# EAGLE design NFC_led_bar (EAGLE 9.6.2)
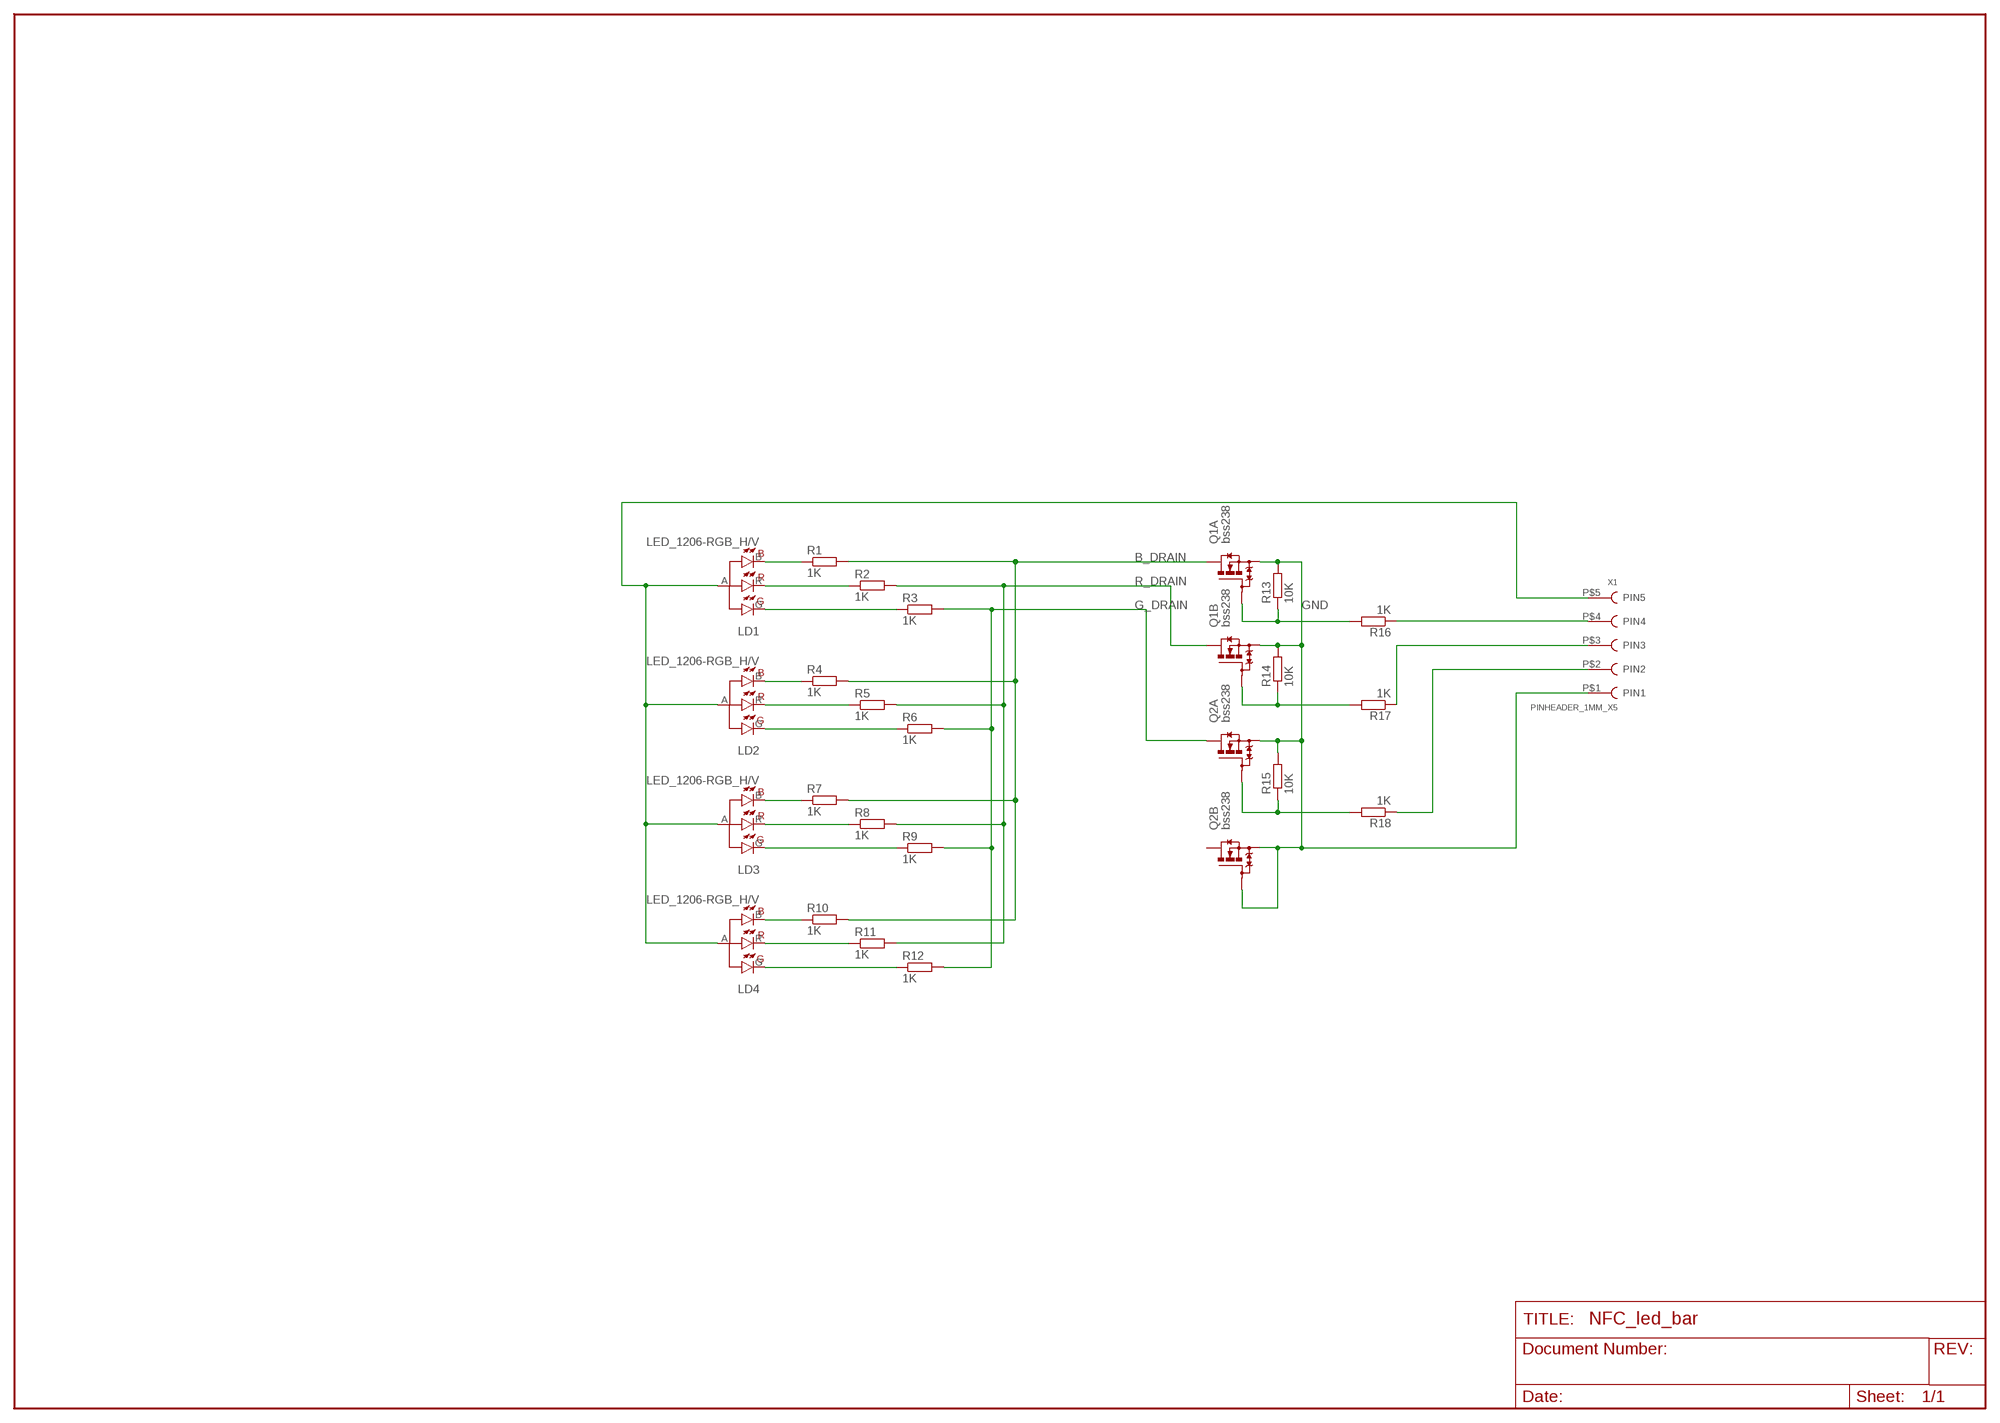
[diagram p0: schematic, sheet 1]

## Parts
LD1  LED_1206-RGB_H/V  [RGB_1206_LED]
LD2  LED_1206-RGB_H/V  [RGB_1206_LED]
LD3  LED_1206-RGB_H/V  [RGB_1206_LED]
LD4  LED_1206-RGB_H/V  [RGB_1206_LED]
Q1  bss238  NTJD5121NT1G  [SOT363]
Q2  bss238  NTJD5121NT1G  [SOT363]
R1  1K  SMD_R0603  [0603]
R2  1K  SMD_R0603  [0603]
R3  1K  SMD_R0603  [0603]
R4  1K  SMD_R0603  [0603]
R5  1K  SMD_R0603  [0603]
R6  1K  SMD_R0603  [0603]
R7  1K  SMD_R0603  [0603]
R8  1K  SMD_R0603  [0603]
R9  1K  SMD_R0603  [0603]
R10  1K  SMD_R0603  [0603]
R11  1K  SMD_R0603  [0603]
R12  1K  SMD_R0603  [0603]
R13  10K  SMD_R0603  [0603]
R14  10K  SMD_R0603  [0603]
R15  10K  SMD_R0603  [0603]
R16  1K  SMD_R0603  [0603]
R17  1K  SMD_R0603  [0603]
R18  1K  SMD_R0603  [0603]
X1  PINHEADER_1MM_X5  [PIN_1MM_X5]

## Nets
B_DRAIN: Q1.6(A:D) R1.2 R4.2 R7.2 R10.2
G_DRAIN: Q2.6(A:D) R3.2 R6.2 R9.2 R12.2
GND: Q1.1(A:S) Q1.4(B:S) Q2.1(A:S) Q2.4(B:S) Q2.5(B:G) R13.2 R14.2 R15.2 X1.P$1(PIN1)
N$1: LD1.A LD2.A LD3.A LD4.A X1.P$5(PIN5)
N$2: Q1.2(A:G) R13.1 R16.2
N$3: LD1.B(BC) R1.1
N$4: LD1.R(RC) R2.1
N$5: LD1.G(GC) R3.1
N$6: LD2.B(BC) R4.1
N$7: LD2.R(RC) R5.1
N$8: LD2.G(GC) R6.1
N$9: LD3.B(BC) R7.1
N$10: LD3.R(RC) R8.1
N$11: LD3.G(GC) R9.1
N$12: LD4.B(BC) R10.1
N$13: LD4.R(RC) R11.1
N$14: LD4.G(GC) R12.1
N$15: Q1.5(B:G) R14.1 R17.2
N$16: Q2.2(A:G) R15.1 R18.2
N$17: R16.1 X1.P$4(PIN4)
N$18: R17.1 X1.P$3(PIN3)
N$19: R18.1 X1.P$2(PIN2)
R_DRAIN: Q1.3(B:D) R2.2 R5.2 R8.2 R11.2
Unconnected: Q2.3(B:D)

## Library data of the parts
LD1-LD4 = passive_components:LED_1206-RGB_H/V
Q1 Q2 = on-semiconductor-ntjd5121nt1g:NTJD5121NT1G: NTJD5121N, Dual N−Channel with ESD Power MOSFET 60 V, 295 mA, Dual N−Channel with ESD Protection, SC−88 Source: Datasheet <http://www.farnell.com/datasheets/1708304.pdf>; MF: ON SEMICONDUCTOR; MPN: NTJD5121NT1G; OC_FARNELL: 2317611; OC_NEWARK: unknown
R1-R18 = passive_components:SMD_R
X1 = Custom connectors:PINHEADER_1MM_X5

## Board
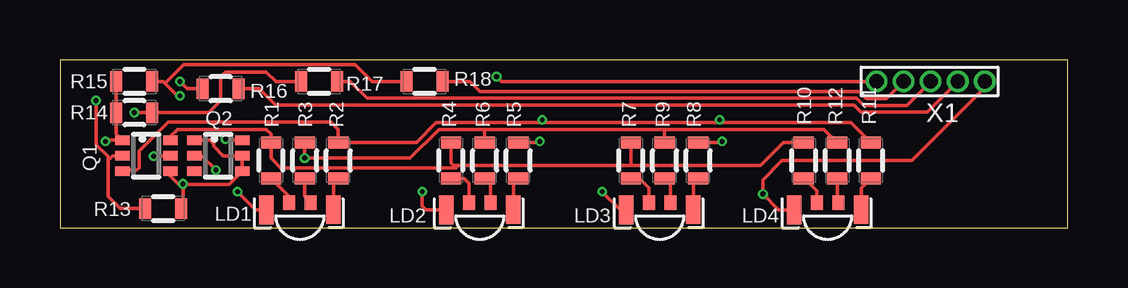
[diagram p1: board, top side]
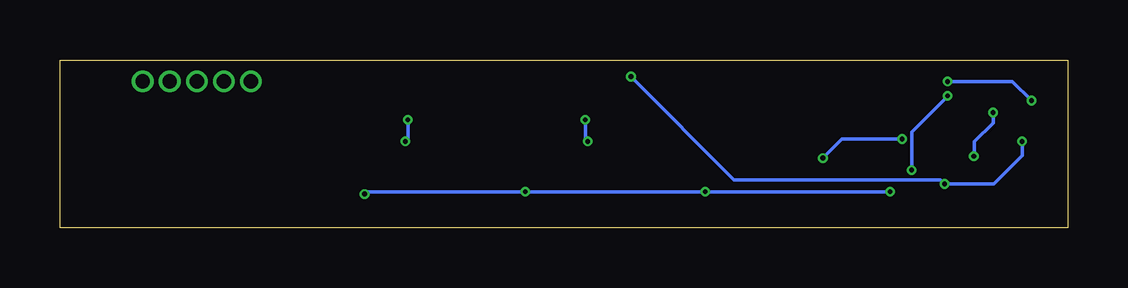
[diagram p2: board, bottom side, seen from below]

Size 42 x 7 mm. Coordinates in mm from the lower left corner, seen from the top.
Outline: 0,0 42,0 42,7 0,7 0,0
Copper layers (1*16): Top 0.035mm / dielectric 1.5mm / Bottom 0.035mm
Design rules "default *": minimum track width 6mil, minimum drill 0.2mm, track to track 5mil, track to pad 4mil, pad to pad 4mil, via to via 4mil, smd to smd 5mil, copper to edge 5mil, drill to drill 6mil, minimum pad ring 4mil, minimum via ring 4mil, stop-mask expansion 4mil, vias tented up to drill 20mil, thermal gap 10mil

### Footprints (pad centres in the part's own frame; a part is rotated, then mirrored left to right if it is on the bottom)
RGB_1206_LED = smd 0.6 x 1.2: A -1.4,0.044; R 1.4,0.05 | smd 0.5 x 0.6: B -0.45,0.35; G 0.45,0.35
SOT363 = smd 0.4 x 0.6: 1 -0.65,-1; 2 0,-1; 3 0.65,-1; 4 0.65,1; 5 0,1; 6 -0.65,1
0603 = smd 0.85 x 0.5: 1 0,0.75; 2 0,-0.75
PIN_1MM_X5 = drill 0.6 pad 0.813: P$1 0.546,0.6; P$2 1.673,0.6; P$3 2.8,0.6; P$4 3.927,0.6; P$5 5.054,0.6

### Placement (x,y rotation side)
LD1  10,0.7 0 top
LD2  17.5,0.7 0 top
LD3  25,0.7 0 top
LD4  32,0.7 0 top
Q1  3.6,3 270 top
Q2  6.6,3 270 top
R1  8.8,2.8 180 top
R2  11.6,2.8 180 top
R3  10.2,2.8 180 top
R4  16.3,2.8 180 top
R5  19.1,2.8 180 top
R6  17.7,2.8 180 top
R7  23.8,2.8 180 top
R8  26.6,2.8 180 top
R9  25.2,2.8 180 top
R10  31,2.8 180 top
R11  33.8,2.8 180 top
R12  32.4,2.8 180 top
R13  4.3,0.8 90 top
R14  3.1,4.8 270 top
R15  3.1,6.1 270 top
R16  6.7,5.8 270 top
R17  10.8,6.1 270 top
R18  15.2,6.1 270 top
X1  33.5,5.5 0 top

### Tracks (layer width: path | path; a pad name or v marks a point on that pad's centre or on a via)
B_DRAIN
  Top 0.152: 16.4,2.6 23.8,2.6 | 23.8,2.6 29.2,2.6 30.15,3.55 R10.2 | R7.2 23.8,2.6 | R4.2 16.3,2.7 16.4,2.6 | 16.4,2.6 16.5,2.5 9.2,2.5 8.8,2.9 R1.2 8.8,3.9 8.6,4.1 4.9,4.1 4.6,3.8 Q1.6
G_DRAIN  (via drill 0.2)
  Top 0.152: R12.2 31.85,4.1 25.2,4.1 | 17.7,4.1 15.8,4.1 14.6,2.9 10.3,2.9 10.2,3 R3.2 v10.2,2.9 | 17.7,4.1 25.2,4.1 | R9.2 25.2,4.1 | R6.2 17.7,4.1 | Q2.6 6.95,3.65 v6.9,3.7
  Bottom 0.152: v6.9,3.7 9.4,3.7 v10.2,2.9
GND  (via drill 0.2)
  Top 0.152: Q2.1 6.25,3.65 6.4,3.5 6.4,3.4 6.8,3 Q2.5 Q2.4 7.05,1.8 5.15,1.8 v5.12,1.82 | v5.12,1.82 4.92,1.82 4.6,2.15 Q1.4 | v1.9,3.6 1.95,3.65 Q1.1 2.35,3.9 R14.2 R15.2 | v5.12,1.82 5.12,0.88 R13.2 | X1.P$1 18.4,6.1 v18.2,6.3
  Bottom 0.152: v1.9,3.6 1.9,3 3.08,1.82 v5.12,1.82 5.3,2 13.9,2 v18.2,6.3
N$1  (via drill 0.2)
  Top 0.152: LD1.A 8.16,0.74 v7.4,1.5 | LD4.A 29.96,0.74 v29.3,1.4 29.3,2 30.1,2.8 35.5,2.8 38.55,5.85 X1.P$5 | LD3.A 23.36,0.74 v22.6,1.5 | LD2.A 15.26,0.74 15.1,0.9 v15.1,1.5
  Bottom 0.152: v7.4,1.5 v15.1,1.5 v22.6,1.5 29.2,1.5 v29.3,1.4
N$2  (via drill 0.2)
  Top 0.152: R13.1 2.5,0.8 2,1.3 2,2.8 | Q1.2 2.2,3 2,2.8 | 2,2.8 2,2.96 1.52,3.44 1.52,5.28 v1.5,5.3 | v5,6.1 5.3,5.8 R16.2
  Bottom 0.152: v1.5,5.3 2.3,6.1 v5,6.1
N$3
  Top 0.152: LD1.B 9.5,1.1 9.5,1.35 R1.1
N$4
  Top 0.152: LD1.R 11.4,1.85 R2.1
N$5
  Top 0.152: LD1.G 10.2,1.3 R3.1
N$6
  Top 0.152: LD2.B 17.05,1.85 16.85,2.05 R4.1
N$7
  Top 0.152: LD2.R 18.9,1.85 R5.1
N$8
  Top 0.152: LD2.G 17.95,1.8 R6.1
N$9
  Top 0.152: LD3.B 24.55,1.65 24.15,2.05 R7.1
N$10
  Top 0.152: LD3.R 26.4,1.85 R8.1
N$11
  Top 0.152: LD3.G 25.45,1.8 R9.1
N$12
  Top 0.152: LD4.B 31.55,1.54 31.04,2.05 R10.1
N$13
  Top 0.152: LD4.R 33.4,1.65 R11.1
N$14
  Top 0.152: LD4.G 32.4,1.1 R12.1
N$15  (via drill 0.2)
  Top 0.152: Q1.5 4.2,3 4.22,2.98 v3.9,2.98 | v3.1,4.8 R14.1 6.2,4.8 6.7,5.3 6.7,6.3 6.9,6.5 8.6,6.5 9,6.1 R17.2
  Bottom 0.152: v3.9,2.98 3.88,3.01 3.88,3.59 3.1,4.37 v3.1,4.8
N$16  (via drill 0.2)
  Top 0.152: R15.1 4.3,6.1 4.35,6.05 | v5,5.5 4.9,5.5 4.35,6.05 | v6.5,2.4 5.9,3 Q2.2 | 4.35,6.05 4.41,6.05 5.16,6.8 12.3,6.8 13,6.1 R18.2
  Bottom 0.152: v5,5.5 6.5,4 v6.5,2.4
N$17
  Top 0.152: R16.1 8.3,5.8 8.98,5.12 33.08,5.12 33.38,4.82 36.15,4.82 X1.P$4
N$18
  Top 0.152: R17.1 12.1,6.1 12.8,5.4 33.2,5.4 33.5,5.1 35.3,5.1 X1.P$3
N$19
  Top 0.152: R18.1 17.1,6.1 17.52,5.68 33.32,5.68 33.62,5.38 34.45,5.38 X1.P$2
R_DRAIN  (via drill 0.2)
  Top 0.152: R11.2 32.97,4.38 27.5,4.38 | 20.1,4.38 15.68,4.38 14.86,3.55 R2.2 11.6,4.1 11.29,4.41 4.5,4.41 3.3,3.2 3.3,2.5 3.2,2.4 2.65,2.4 Q1.3 | 20.1,4.38 27.5,4.38 | R5.2 19.95,3.55 v20,3.6 | v20.1,4.5 20.1,4.38 | R8.2 27.55,3.55 v27.6,3.6 | v27.5,4.5 27.5,4.38
  Bottom 0.152: v20,3.6 20.1,3.7 v20.1,4.5 | v27.6,3.6 27.5,3.7 v27.5,4.5